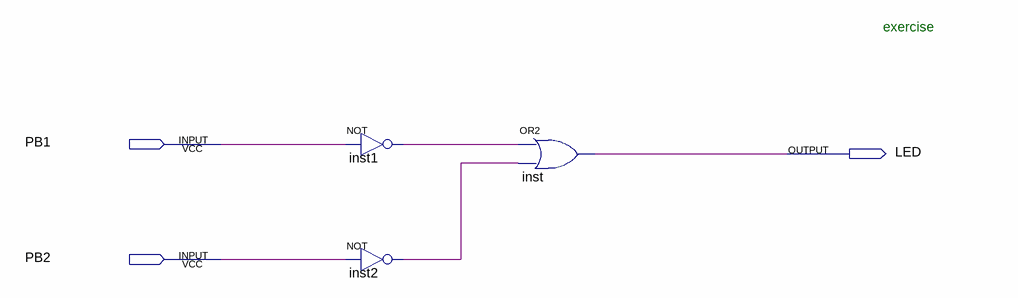
[diagram p0: schematic sheet]
// Quartus schematic first_exercise.bdf as structural Verilog: 3 symbols, 3 pins
module first_exercise (
  input  PB1,
  input  PB2,
  output LED
);

  wire inst1_out, inst2_out;

  not inst1 (inst1_out, PB1);
  not inst2 (inst2_out, PB2);
  or inst (LED, inst1_out, inst2_out);

  // Notes on the sheet:
  //   exercise 
endmodule
